# EAGLE design shield (EAGLE 6.6.0)

## Sheet 1 of 2
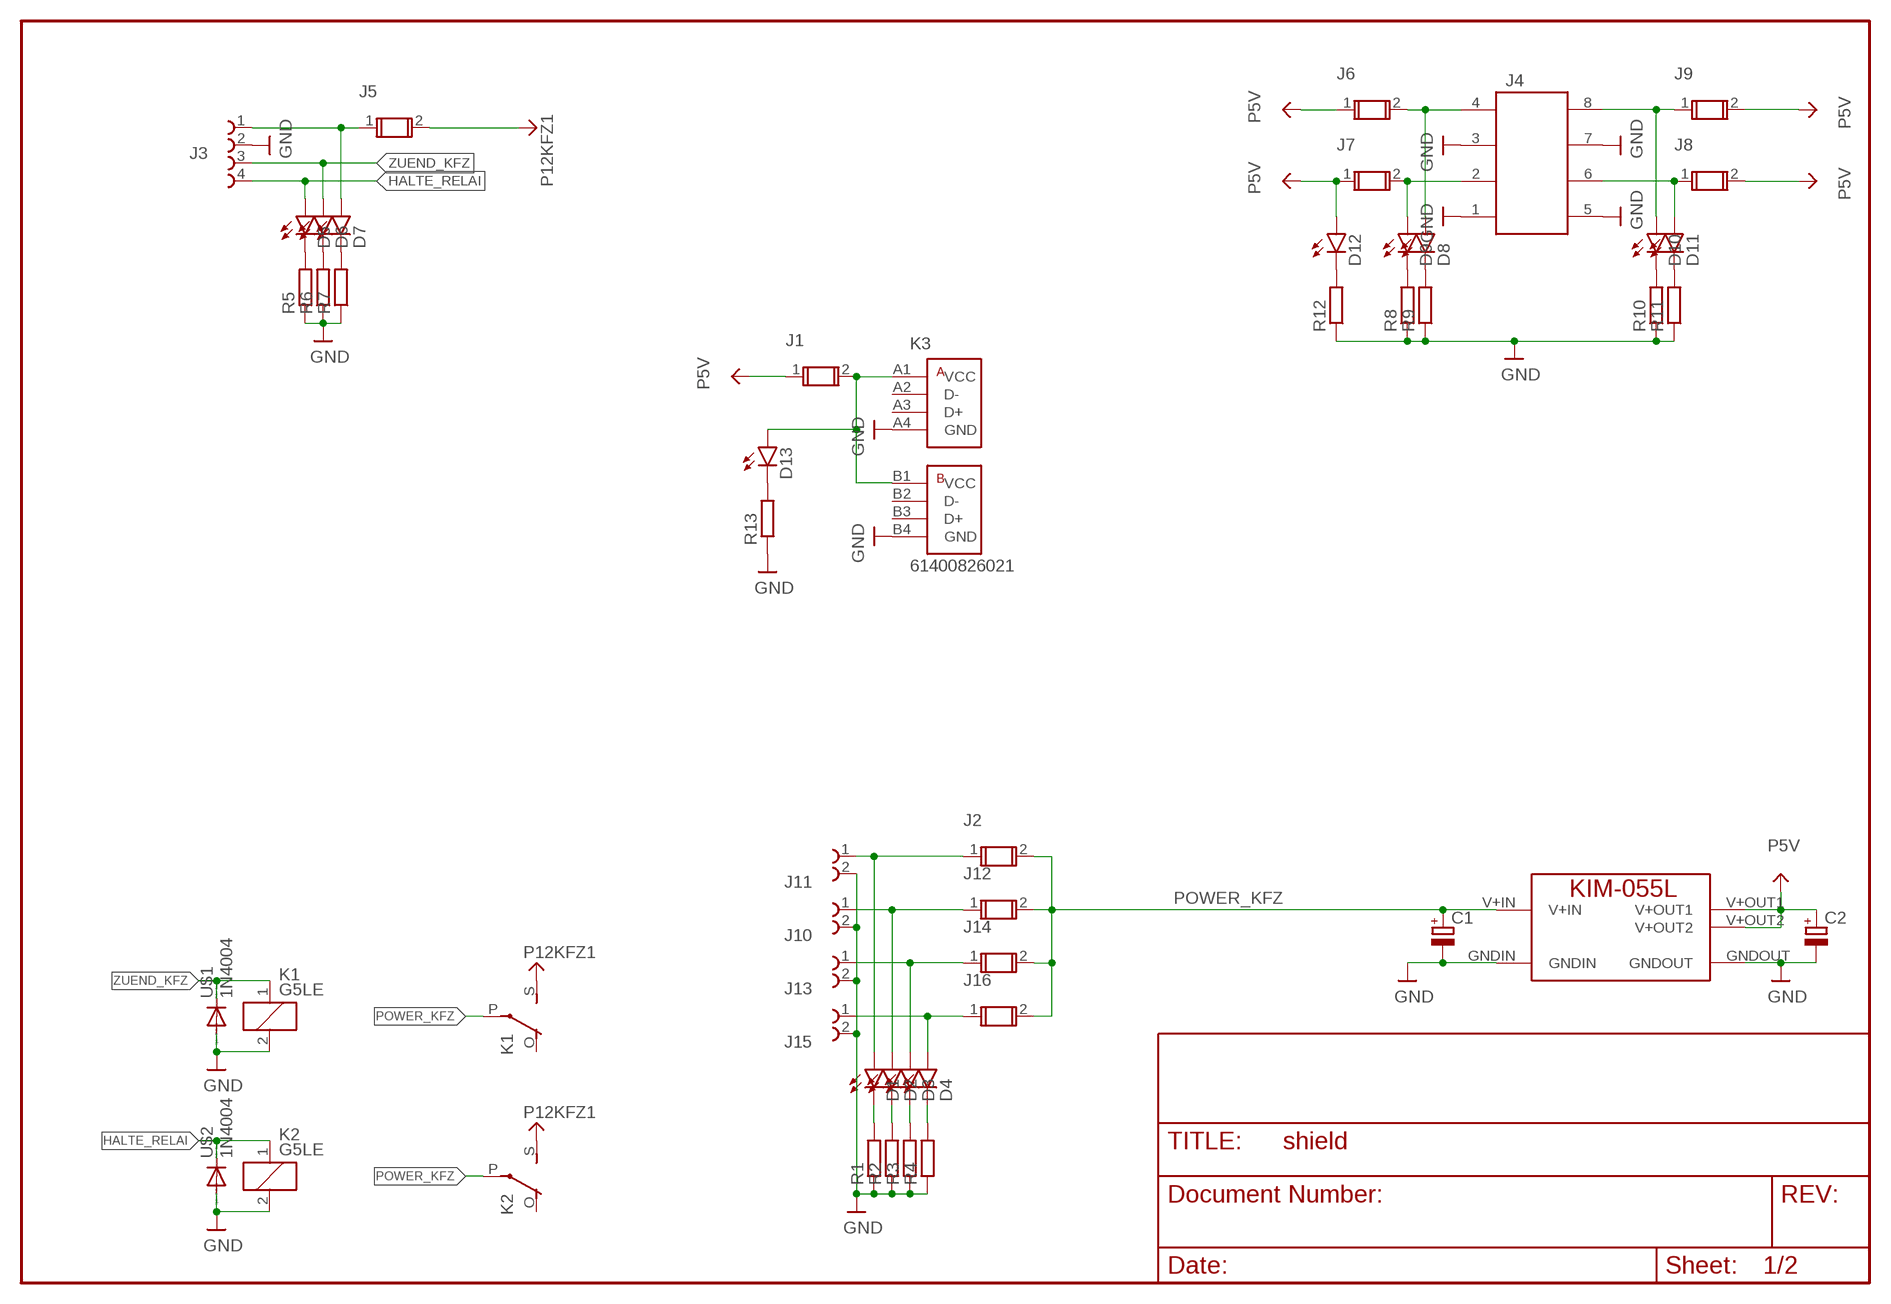
[diagram p0: schematic, sheet 1]

### Parts
C1  CPOL-EUE5-13  [E5-13]
C2  CPOL-EUE5-13  [E5-13]
D1  LED-3MM-NO_SILK  [LED3MM-NS]
D2  LED-3MM-NO_SILK  [LED3MM-NS]
D3  LED-3MM-NO_SILK  [LED3MM-NS]
D4  LED-3MM-NO_SILK  [LED3MM-NS]
D5  LED-3MM-NO_SILK  [LED3MM-NS]
D6  LED-3MM-NO_SILK  [LED3MM-NS]
D7  LED-3MM-NO_SILK  [LED3MM-NS]
D8  LED-3MM-NO_SILK  [LED3MM-NS]
D9  LED-3MM-NO_SILK  [LED3MM-NS]
D10  LED-3MM-NO_SILK  [LED3MM-NS]
D11  LED-3MM-NO_SILK  [LED3MM-NS]
D12  LED-3MM-NO_SILK  [LED3MM-NS]
D13  LED-3MM-NO_SILK  [LED3MM-NS]
J1  696101000002  [696101000002]
J2  696101000002  [696101000002]
J3  691325110004  [691325110004]
J4  691327310008  [691327310008]
J5  696101000002  [696101000002]
J6  696101000002  [696101000002]
J7  696101000002  [696101000002]
J8  696101000002  [696101000002]
J9  696101000002  [696101000002]
J10  691322110002  [691322110002]
J11  691322110002  [691322110002]
J12  696101000002  [696101000002]
J13  691322110002  [691322110002]
J14  696101000002  [696101000002]
J15  691322110002  [691322110002]
J16  696101000002  [696101000002]
K1  G5LE  [G5LE]
K2  G5LE  [G5LE]
K3  61400826021  [61400826021]
MOD1  KIM-055L  [KIM-055L]
R1  R-EU_0309/V  [0309V]
R2  R-EU_0309/V  [0309V]
R3  R-EU_0309/V  [0309V]
R4  R-EU_0309/V  [0309V]
R5  R-EU_0309/V  [0309V]
R6  R-EU_0309/V  [0309V]
R7  R-EU_0309/V  [0309V]
R8  R-EU_0309/V  [0309V]
R9  R-EU_0309/V  [0309V]
R10  R-EU_0309/V  [0309V]
R11  R-EU_0309/V  [0309V]
R12  R-EU_0309/V  [0309V]
R13  R-EU_0309/V  [0309V]
U$1  1N4004  [DO41-10]
U$2  1N4004  [DO41-10]

### Nets
GND: C1.- C2.- J3.2 J4.1 J4.3 J4.5 J4.7 J10.2 J11.2 J13.2 J15.2 K1.2 K2.2 K3.A4(GND) K3.B4(GND) MOD1.GNDIN MOD1.GNDOUT R1.1 R2.1 R3.1 R4.1 R5.1 R6.1 R7.1 R8.1 R9.1 R10.1 R11.1 R12.1 R13.1 U$1.A U$2.A
HALTE_RELAI: D5.A J3.4 K2.1 U$2.C
N$1: D7.A J3.1 J5.1
N$2: D11.A J4.6 J8.1
N$3: D1.A J2.1 J11.1
N$4: D10.A J4.8 J9.1
N$5: D8.A J4.4 J6.2
N$6: D9.A J4.2 J7.2
N$7: D2.A J10.1 J12.1
N$8: D3.A J13.1 J14.1
N$9: D4.A J15.1 J16.1
N$10: D1.K(C) R1.2
N$11: D2.K(C) R2.2
N$12: D3.K(C) R3.2
N$13: D4.K(C) R4.2
N$14: D5.K(C) R5.2
N$15: D6.K(C) R6.2
N$16: D7.K(C) R7.2
N$17: D12.K(C) R12.2
N$18: D9.K(C) R8.2
N$19: D8.K(C) R9.2
N$20: D10.K(C) R10.2
N$21: D11.K(C) R11.2
N$22: D13.A J1.2 K3.A1(VCC) K3.B1(VCC)
N$23: D13.K(C) R13.2
P5V: C2.+ D12.A J1.1 J6.1 J7.1 J8.2 J9.2 MOD1.V+OUT1 MOD1.V+OUT2
P12KFZ1: J5.2 K1.S(2:S) K2.S(2:S)
POWER_KFZ: C1.+ J2.2 J12.2 J14.2 J16.2 K1.P(2:P) K2.P(2:P) MOD1.V+IN
ZUEND_KFZ: D6.A J3.3 K1.1 U$1.C
Unconnected: K1.O(2:O) K2.O(2:O) K3.A2(D-) K3.A3(D+) K3.B2(D-) K3.B3(D+)

## Sheet 2 of 2

## Library data of the parts
C1 C2 = schlager_passiv:CPOL-EU: POLARIZED CAPACITOR, European symbol
D1-D13 = debauer_led:LED: LEDs Standard schematic elements and footprints for 5mm, 3mm, 1206, and 0603 sized LEDs. 5mm - Spark Fun Electronics SKU : COM-00529 (and others)
J1 J2 J5-J9 J12 J14 J16 = Wuerth_FUSEHOLDERS_rev16a:696101000002: WR-FSH PTF/15 FUSEHOLDER BLOCKS - PCB - CLIP COVER - THT ;=>Code : Con_FSH_Blocks_696101000002_696101000002 <http://katalog.we-online.de/media/images/eican/Con_FSH_Blocks_696101000002_pf2.jpg> Details see: http://katalog.we-online.de/em/datasheet/696101000002.pdf Created 2014-10-08, Karrer Zheng 2014 (C) Wurth Elektronik
J3 = Wuerth_TERMINAL_BLOCKS-rev16e:691325110004: WR-TBL Serie 3251 - 3.5mm Horizontal PCB Header with Flanges , 4 Pins=>Code : Con_TBL_Pluggable_3.50_PCB_H_691325110004 <http://katalog.we-online.de/media/images/eican/Con_TBL_Pluggable_3.50_PCB_H_6913251100xx_pf2.jpg> Details see: http://katalog.we-online.de/en/em/TBL_3_50_3251_HORIZONTAL_PCB_HEADER_W_FLANGES_69132511000X Created 2014-06-19, Karrer Zheng 2014 (C) Würth Elektronik
J4 = Wuerth_TERMINAL_BLOCKS-rev16e:691327310008: WR-TBL Serie 3273 – 3.81mm Close Horizontal Dual Row PCB Header, 8 Pins=>Code : Con_TBL_Pluggable_3.81_PCB_THT_Double_691327310008 <http://katalog.we-online.de/media/images/eican/Con_TBL_Pluggable_3.81_PCB_THT_Double_6913273100xx_pf2.jpg> Details see: http://katalog.we-online.de/en/em/TBL_3_81_3273_DOUBLE_LEVEL_HORIZONTAL_MALE_PCB_HEADER_W_FLANGES_6913273100XX Created 2014-06-19, Karrer Zheng 2014 (C) Würth Elektronik
J10 J11 J13 J15 = Wuerth_TERMINAL_BLOCKS-rev16e:691322110002: WR-TBL Serie 3221 - 3.50mm Horizontal PCB Header, 2 Pins=>Code : Con_TBL_Pluggable_3.50_PCB_H_691322110002 <http://katalog.we-online.de/media/images/eican/Con_TBL_Pluggable_3.50_PCB_H_6913221100xx_pf2.jpg> Details see: http://katalog.we-online.de/en/em/TBL_3_50_3221_HORIZONTAL_PCB_HEADER_69132211000X Created 2014-06-18, Karrer Zheng 2014 (C) Würth Elektronik
K1 K2 = relay:G5LE: RELAY 1 x switch, 10 A/120 V AC, 8 A/30 V DC, Omron; OC_FARNELL: unknown; OC_NEWARK: unknown
K3 = Wuerth_Elektronik_eiCan_Communication_Connectors:61400826021: WR-COM Horizontal Dual Stacked USB Type A
MOD1 = kim055l:KIM-055L: 5V 5amp DC DC module. IMPORANT: Add low ESR input & output capacitors. V+OUT1 & V+OUT2 internally connected.
R1-R13 = debauer_passiv:R-EU_: RESISTOR, European symbol
U$1 U$2 = diode:1N4004: DIODE general purpose rectifier, 1 A

## Board
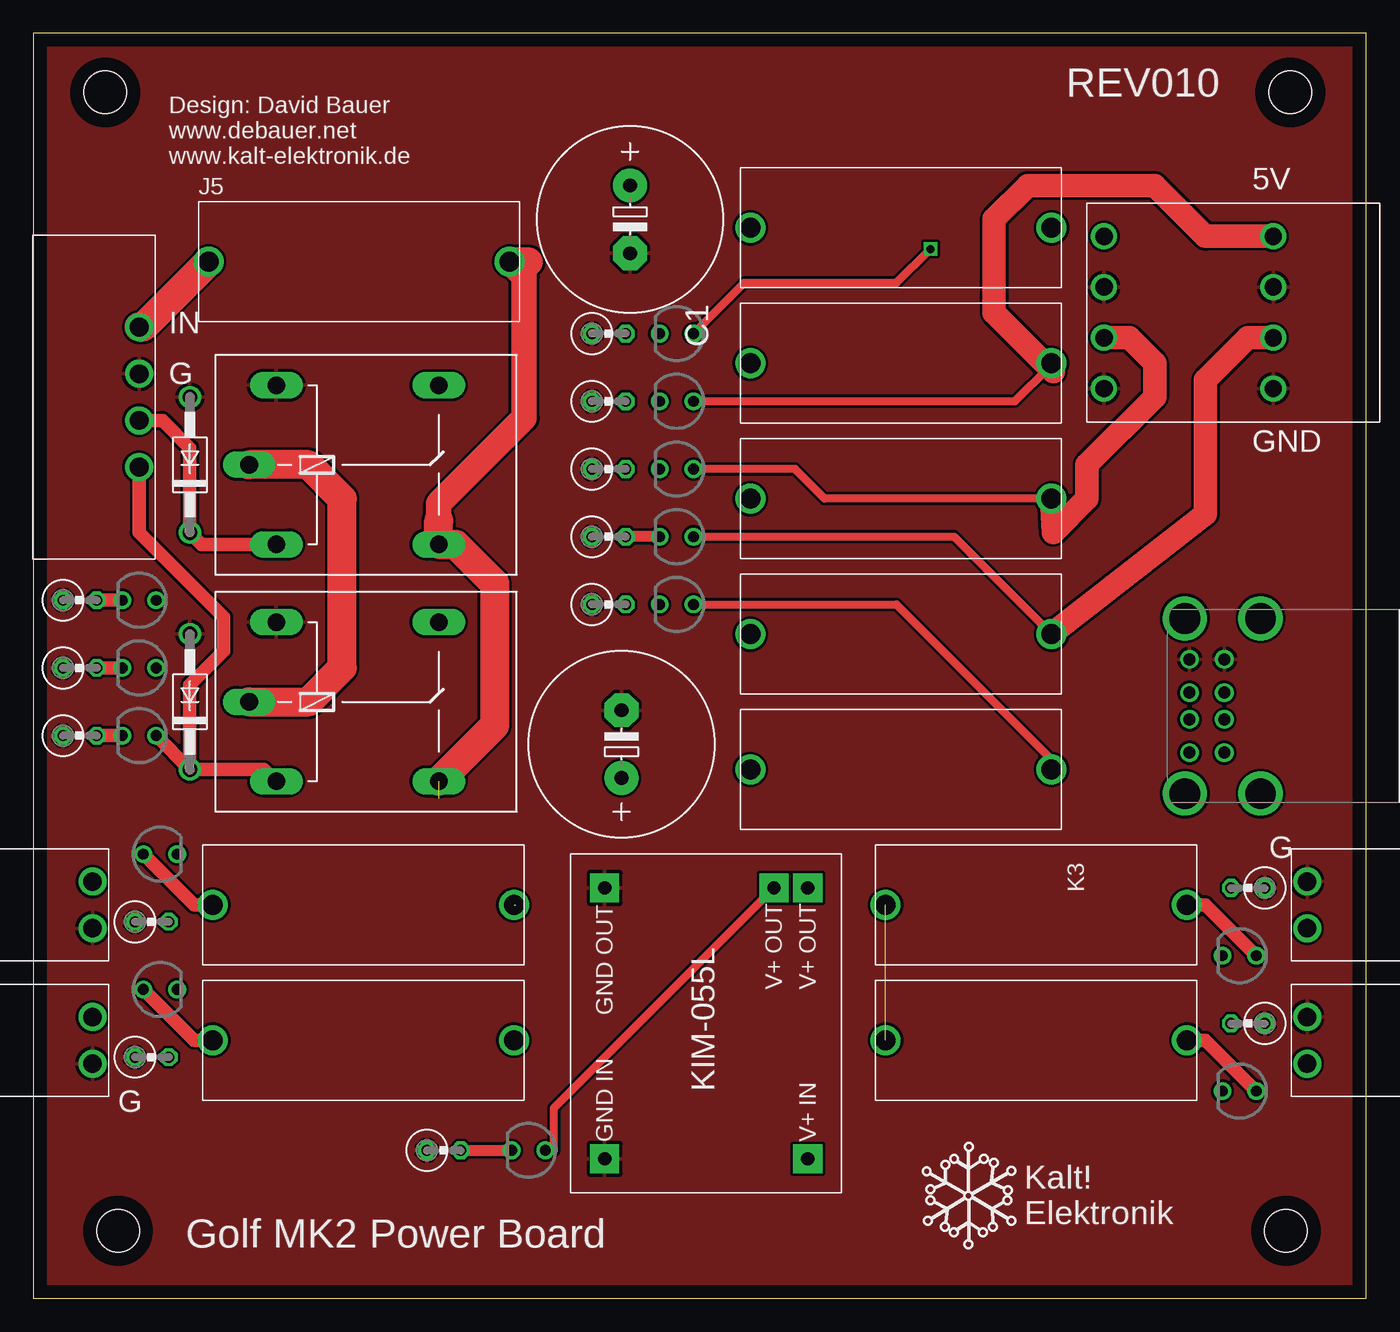
[diagram p1: board, top side]
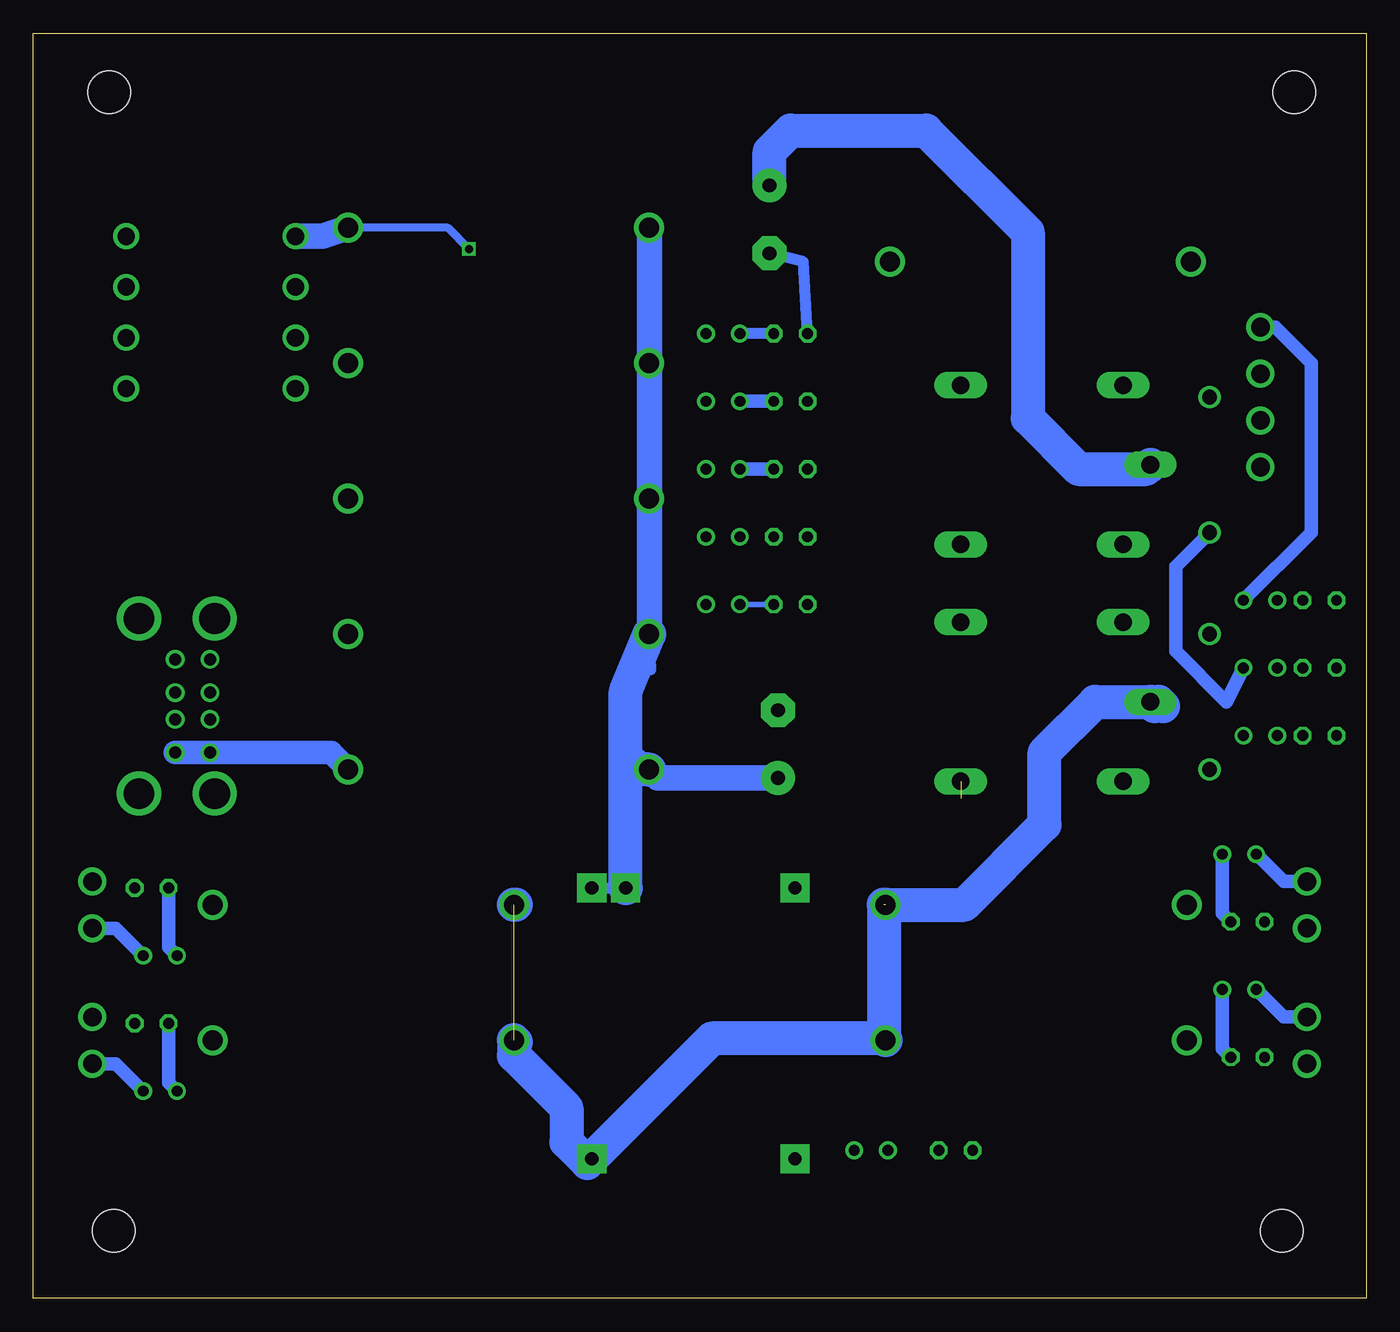
[diagram p2: board, bottom side, seen from below]

Size 100 x 94.92 mm. Coordinates in mm from the lower left corner, seen from the top.
Outline: 0,0 100,0 100,94.92 0,94.92 0,0
Copper layers (1*16): Top 0.035mm / dielectric 1.5mm / Bottom 0.035mm
Design rules "default": minimum track width 10mil, minimum drill 24mil, track to track 8mil, track to pad 8mil, pad to pad 8mil, via to via 8mil, smd to smd 8mil, copper to edge 40mil, drill to drill 8mil, minimum pad ring 10mil, minimum via ring 8mil, stop-mask expansion 4mil, vias tented up to drill 0mil, thermal gap 10mil
Holes 3.2 mm at 93.98,5.08 5.4,90.49 94.3,90.49 6.35,5.08

### Footprints (pad centres in the part's own frame; a part is rotated, then mirrored left to right if it is on the bottom)
E5-13 = drill 1.016 pad 2.54: + -2.54,0 | drill 1.016 pad 2.54 octagon: - 2.54,0
LED3MM-NS = drill 0.813: A -1.27,0; K 1.27,0
696101000002 = drill 1.5: 1 -11.3,0; 2 11.3,0
691325110004 = drill 1.4: 1 -5.25,0; 2 -1.75,0; 3 1.75,0; 4 5.25,0
691327310008 = drill 1.3: 1 -5.715,6.35; 2 -1.905,6.35; 3 1.905,6.35; 4 5.715,6.35; 5 -5.715,-6.35; 6 -1.905,-6.35; 7 1.905,-6.35; 8 5.715,-6.35
691322110002 = drill 1.4: 1 -1.75,0; 2 1.75,0
G5LE = drill 1.321 long: 1 -7.493,-5.969; 2 -7.493,5.969; O 4.699,5.969; P -9.525,0; S 4.699,-5.969
61400826021 = drill 2.3: 5 -6.57,5.68; 6 -6.57,0; 7 6.57,0; 8 6.57,5.68 | drill 0.9: A1 -3.5,5.33; A2 -1,5.33; A3 1,5.33; A4 3.5,5.33; B1 -3.5,2.71; B2 -1,2.71; B3 1,2.71; B4 3.5,2.71
KIM-055L = drill 1 pad 2.184 square: GNDIN -10.16,7.62; GNDOUT 10.16,7.62; V+IN -10.16,-7.62; V+OUT1 10.16,-5.08; V+OUT2 10.16,-7.62
0309V = drill 0.813 octagon: 1 -1.27,0; 2 1.27,0
DO41-10 = drill 1.118: A 5.08,0; C -5.08,0

### Placement (x,y rotation side)
C1  44.77,80.96 270 top
C2  44.13,41.59 90 top
D1  9.53,33.34 0 top
D2  9.53,23.18 0 top
D3  90.49,15.56 180 top
D4  90.49,25.72 180 top
D5  7.94,42.23 180 top
D6  7.94,47.31 180 top
D7  7.94,52.39 180 top
D8  48.26,72.39 180 top
D9  48.26,62.23 180 top
D10  48.26,67.31 180 top
D11  48.26,57.15 180 top
D12  37.15,11.11 180 top
D13  48.26,52.07 180 top
J1  65.09,39.69 0 top
J2  24.77,29.53 0 top
J3  7.94,67.63 270 top
J4  86.68,73.98 90 top
J5  24.45,77.79 0 top
J6  65.09,80.33 0 top
J7  65.09,60.01 0 top
J8  65.09,49.85 180 top
J9  65.09,70.17 180 top
J10  4.45,19.37 270 top
J11  4.45,29.53 270 top
J12  24.77,19.37 0 top
J13  95.57,19.37 90 top
J14  75.25,19.37 180 top
J15  95.57,29.53 90 top
J16  75.25,29.53 180 top
K1  25.72,62.55 0 top
K2  25.72,44.77 0 top
K3  92.08,44.45 90 top
MOD1  50.48,20.64 90 top
R1  8.89,28.26 0 top
R2  8.89,18.1 0 top
R3  91.12,20.64 180 top
R4  91.12,30.8 180 top
R5  3.49,42.23 0 top
R6  3.49,47.31 0 top
R7  3.49,52.39 0 top
R8  43.18,62.23 0 top
R9  43.18,72.39 0 top
R10  43.18,67.31 0 top
R11  43.18,57.15 0 top
R12  30.8,11.11 0 top
R13  43.18,52.07 0 top
U$1  11.75,62.55 90 top
U$2  11.75,44.77 90 top
U$11  [KALT!ELEKTRONIK]  77.47,7.62 0 top
U$12  [DISCLAIMER]  17.78,87.63 0 top

### Tracks (layer width: path | path; a pad name or v marks a point on that pad's centre or on a via)
GND
  Bottom 0.813: R9.1 42.23,77.79 C1.-
  pour Top: -10.16,110.49 109.22,110.49 109.22,-3.81 -10.16,-3.81
HALTE_RELAI
  Top 1.016: U$2.C 17.34,39.69 K2.1 | D5.A U$2.C | J3.4 7.94,57.47 14.29,51.12 14.29,48.58 11.75,46.04 U$2.C
N$1
  Top 2.184: J3.1 8.24,72.88 J5.1
  Bottom 1.016: J3.1 6.84,72.88 4.13,70.17 4.13,57.47 D7.A
N$2
  Top 0.61: D11.A 69.08,57.15 J8.1
  Top 1.778: J4.6 91.12,72.07 87.95,68.9 87.95,58.87 J8.1
N$3
  Top 1.016: J2.1 12.06,29.53 D1.A
  Bottom 1.016: J11.1 6.2,31.28 D1.A
N$4
  Top 0.61: D10.A 73.66,67.31 76.2,69.85
  Top 1.778: J4.8 87.95,79.69 84.14,83.5 74.61,83.5 72.07,80.96 72.07,73.98 76.2,69.85 76.52,69.53 76.52,70.04 J9.1
N$5  (via drill 0.6)
  Top 0.61: D8.A 53.34,76.2 64.77,76.2 v67.31,78.74
  Bottom 0.61: v67.31,78.74 68.9,80.33 J6.2
  Bottom 1.93: J4.4 78.29,79.69 J6.2
N$6
  Top 0.61: J7.2 59.37,60.01 57.15,62.23 D9.A
  Top 1.778: J4.2 82.23,72.07 84.14,70.17 84.14,67.63 79.06,62.55 79.06,60.01 76.52,57.47 J7.2
N$7
  Top 1.016: J12.1 12.06,19.37 D2.A
  Bottom 1.016: J10.1 6.2,21.12 D2.A
N$8
  Top 1.016: J14.1 87.95,19.37 D3.A
  Bottom 1.016: J13.1 93.82,17.62 D3.A
N$9
  Top 1.016: J16.1 87.95,29.53 D4.A
  Bottom 1.016: J15.1 93.82,27.78 D4.A
N$10
  Bottom 1.016: D1.K 10.79,28.89 R1.2
N$11
  Bottom 1.016: D2.K 10.79,18.73 R2.2
N$12
  Bottom 1.016: R3.2 89.85,16.19 D3.K
N$13
  Bottom 1.016: R4.2 89.85,26.35 D4.K
N$14
  Top 1.016: D5.K R5.2
N$15
  Top 1.016: D6.K R6.2
N$16
  Top 1.016: R7.2 D7.K
N$17
  Top 0.813: R12.2 D12.K
N$18
  Bottom 1.016: D9.K R8.2
N$19
  Bottom 0.813: R9.2 D8.K
N$20
  Bottom 1.016: D10.K R10.2
N$21
  Top 0.813: D11.K R11.2
N$22
  Top 0.61: D13.A 64.77,52.07 76.39,40.45 J1.2
  Bottom 1.778: J1.2 77.65,40.95 K3.A1 K3.B1
N$23
  Bottom 0.406: D13.K R13.2
P5V
  Top 0.61: 39.05,11.11 39.05,11.43 | 39.05,11.43 39.05,14.29 MOD1.V+OUT1 | D12.A 38.73,11.11 39.05,11.43
  Bottom 0.813: MOD1.V+OUT2 MOD1.V+OUT1 | 53.66,47.18 J8.2
  Bottom 1.93: J8.2 J7.1 J9.2 J6.1 | C2.+ 53.15,39.05 J1.1
  Bottom 2.54: MOD1.V+OUT1 55.56,40.64 | 55.56,40.64 55.56,45.53 J8.2 | J1.1 54.61,39.69 55.56,40.64
P12KFZ1  (1 unrouted)
  Top 1.93: 30.42,58.36 30.42,59.63 36.83,66.04 36.83,76.7 J5.2
  Top 2.184: 30.42,58.36 K1.S 31.69,56.58 34.61,53.66 34.61,42.99 K2.S | J5.2 37.15,77.79
POWER_KFZ  (2 unrouted)
  Top 2.184: K2.P 20.64,44.77 23.18,47.31 23.18,60.01 20.64,62.55 K1.P
  Bottom 2.54: 63.82,29.53 J16.2 | 63.82,19.24 J14.2 63.95,18.23 60.01,14.29 60.01,11.75 58.42,10.16 MOD1.V+IN 49.08,19.5 36.2,19.5 | 36.2,29.53 36.2,19.5 | 36.2,19.5 J12.2 | J2.2 30.16,29.53 24.13,35.56 24.13,40.96 20.32,44.77 K2.P | K2.P 15.56,44.77 15.24,44.45 15.88,44.45 K2.P | C1.+ 44.77,86.04 43.18,87.63 33.02,87.63 25.4,80.01 25.4,66.04 21.59,62.23 16.51,62.23 K1.P
ZUEND_KFZ
  Top 1.016: K1.1 12.64,56.58 U$1.C 11.75,63.82 9.69,65.88 J3.3
  Bottom 1.016: D6.A 10.48,44.77 14.29,48.58 14.29,54.93 U$1.C

### Text on the board
tPlace: REV010 | 5V | IN | G | GND | G | G | Golf MK2 Power Board